# Altium schematic sheet [3] Audio Codec.SchDoc
size Letter
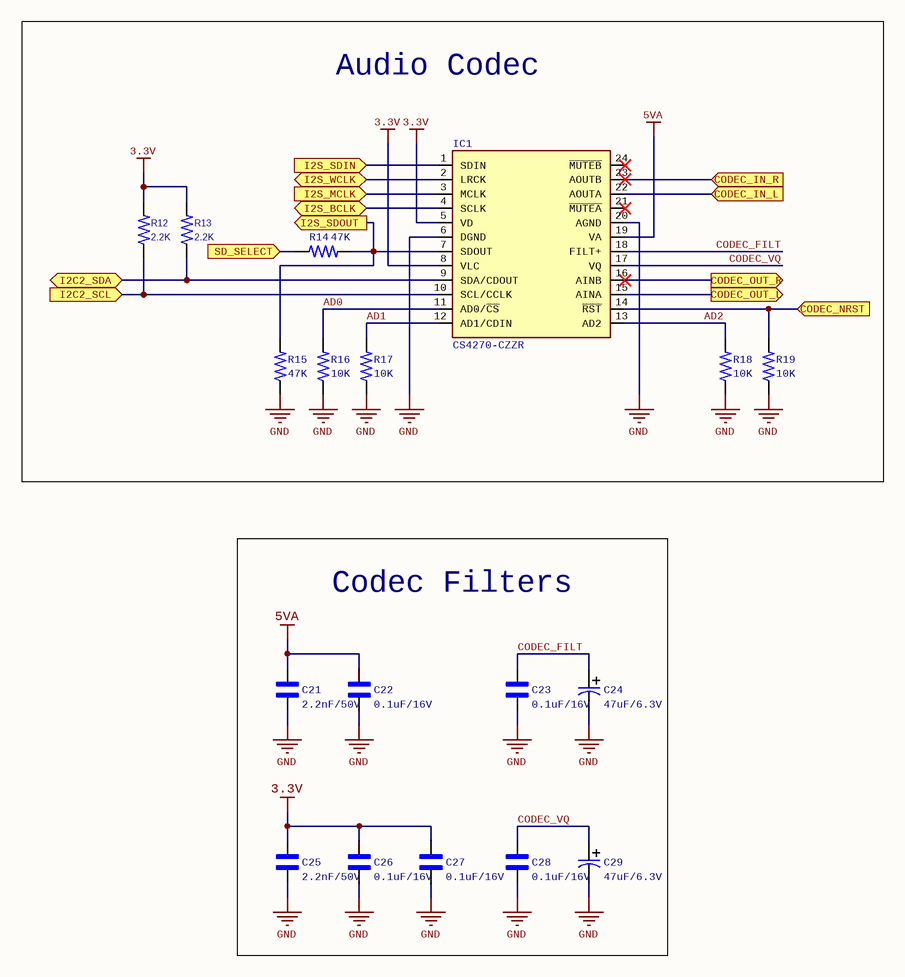
[diagram p0: [3] Audio Codec.SchDoc]

## Parts
C21  2.2nF/50V  [C0603]
C22  0.1uF/16V  [C0603]
C23  0.1uF/16V  [C0603]
C24  47uF/6.3V  [EIA1206]
C25  2.2nF/50V  [C0603]
C26  0.1uF/16V  [C0603]
C27  0.1uF/16V  [C0603]
C28  0.1uF/16V  [C0603]
C29  47uF/6.3V  [EIA1206]
IC1  CS4270-CZZR  [TSSOP-24]
R12  2.2K  [R0603]
R13  2.2K  [R0603]
R14  47K  [R0603]
R15  47K  [R0603]
R16  10K  [R0603]
R17  10K  [R0603]
R18  10K  [R0603]
R19  10K  [R0603]

## Blocks framed on the sheet
Audio Codec: IC1 R12-R19
Codec Filters: C21-C29

## Ports
CODEC_IN_L (in), CODEC_IN_R (in), CODEC_NRST (in), CODEC_OUT_L (out), CODEC_OUT_R (out), I2C2_SCL (in), I2C2_SDA (bidir), I2S_BCLK (bidir), I2S_MCLK (in), I2S_SDIN (in), I2S_SDOUT (out), I2S_WCLK (bidir), SD_SELECT (in)

## Nets
3.3V: C25.1 C26.2 C27.2 IC1.5(VD) IC1.8(VLC) R12.2 R13.2
5VA: C21.1 C22.2 IC1.19(VA)
GND: C21.2 C22.1 C23.1 C24.2 C25.2 C26.1 C27.1 C28.1 C29.2 IC1.6(DGND) IC1.20(AGND) R15.1 R16.1 R17.1 R18.1 R19.1
AD0: IC1.11(AD0/~{CS}) R16.2
AD1: IC1.12(AD1/CDIN) R17.2
AD2: IC1.13(AD2) R18.2
CODEC_FILT: C23.2 C24.1 IC1.18(FILT+)
CODEC_IN_L: IC1.22(AOUTA) ; port CODEC_IN_L
CODEC_IN_R: IC1.23(AOUTB) ; port CODEC_IN_R
CODEC_NRST: IC1.14(~{RST}) R19.2 ; port CODEC_NRST
CODEC_OUT_L: IC1.15(AINA) ; port CODEC_OUT_L
CODEC_OUT_R: IC1.16(AINB) ; port CODEC_OUT_R
CODEC_VQ: C28.2 C29.1 IC1.17(VQ)
I2C2_SCL: IC1.10(SCL/CCLK) R12.1 ; port I2C2_SCL
I2C2_SDA: IC1.9(SDA/CDOUT) R13.1 ; port I2C2_SDA
I2S_BCLK: IC1.4(SCLK) ; port I2S_BCLK
I2S_MCLK: IC1.3(MCLK) ; port I2S_MCLK
I2S_SDIN: IC1.1(SDIN) ; port I2S_SDIN
I2S_SDOUT: IC1.7(SDOUT) R14.2 R15.2 ; port I2S_SDOUT
I2S_WCLK: IC1.2(LRCK) ; port I2S_WCLK
SD_SELECT: R14.1 ; port SD_SELECT

Not connected (* = marked no-connect by the designer): IC1 21(~{MUTEA})* 24(~{MUTEB})*

## Library data of the parts
C21 C25 = C0603 2.2nF/50V: MLCC 2.2nF 10V X5R 10% 0603; Manufacturer: Samsung; Manufacturer Part Number: CL10B222KB8NFNC; Voltage Rating: 50V; Dielectric: X7R; Supplier 1: Mouser; Supplier Part Number 1: 187-CL10B222KB8NFNC; RoHS: Yes; Category: Ceramic Capacitors; Stock 1: 114857; Pricing 1: 1=0.10000, 10=0.03800, 50=0.03800, 100=0.01700, 1000=0.00900, 10000=0.00600 (USD); Mount: Surface Mount; Case/Package: 0603; Case Code (Metric): 1608; Case Code (Imperial): 0603; Min Operating Temperature: -55°C; Max Operating Temperature: 125°C; Package Quantity: 1; Packaging: Tape and Reel; Capacitance: 2.2nF; Tolerance: 10%; Series: CL; Construction: Flat; Length: 0.063inch; Width: 0.031inch; Height: 0.8mm; Thickness: 0.035inch; Depth: 0.8mm; Radiation Hardening: No; RoHS Compliant: Yes
C22 C23 C26-C28 = C0603 0.1uF/16V: MLCC 0.1UF, 16V, X5R, 10%, 0603.; Manufacturer: Kyocera AVX; Manufacturer Part Number: 0603YD104KAT2A; Capacitance: 100nF; Supplier 1: Mouser; Supplier Part Number 1: 581-0603YD104KAT2A; RoHS: Yes; Category: Ceramic Capacitors; Stock 1: 3315; Pricing 1: 1=0.26000, 10=0.11400, 50=0.11400, 100=0.09700, 1000=0.05900, 10000=0.04800 (USD); Mount: Surface Mount; Case/Package: 0603; Number of Pins: 2; Case Code (Imperial): 0603; Case Code (Metric): 1608; Min Operating Temperature: -55°C; Max Operating Temperature: 85°C; Package Quantity: 4000; Voltage Rating: 16V; Voltage Rating (DC): 16V; Tolerance: 10%; Packaging: Tape and Reel; Dielectric: X5R; Termination: SMD/SMT; Length: 1.6mm; Width: 0.81mm; Height: 0.9mm; Thickness: 0.035inch; Depth: 0.81mm; Lead Free: Lead Free; ComponentLink1URL: https://datasheet.ciiva.com/11504/cx5r-11504040.pdf?src-supplier=Avnet; ComponentLink1Description: https://datasheet.ciiva.com/11504/cx5r-11504040.pdf?src-supplier=Avnet; ComponentLink2URL: https://datasheet.ciiva.com/208/cx5r-208121.pdf?src-supplier=Digi-Key; ComponentLink2Description: https://datasheet.ciiva.com/208/cx5r-208121.pdf?src-supplier=Digi-Key
C24 C29 = TANT 47UF/6.3V: Tantalum Capacitors - Solid SMD 6.3V 47uF 10%; Manufacturer: Kyocera AVX; Manufacturer Part Number: TAJA476K006SNJV; Supplier 1: Mouser; Supplier Part Number 1: 581-TAJA476K006SNJV; RoHS: Yes; Category: Tantalum Capacitors; Stock 1: 97469; Pricing 1: 1=0,57000, 10=0,39900, 50=0,39900, 100=0,20200, 1000=0,15200, 10000=0,12500 (USD); Case/Package: Radial; Voltage Rating (DC): 6.3V; Capacitance: 47uF; Tolerance: 10%; Lead Free: Lead Free; RoHS Compliant: Yes
IC1 = CS4270-CZZR: Audio Codec 2ADC / 2DAC 24-Bit 24-Pin TSSOP T/R (Alt: CS4270-CZZR); Manufacturer: Cirrus Logic; Interface: I2C,SPI,Serial; Resolution: 24b; Number of A/D Converters: 2; Sampling Rate: 216KS/s; Supplier 1: Mouser; Manufacturer Part Number: CS4270-CZZR; RoHS: Yes; Category: CODECs; Stock 1: 20885; Pricing 1: 1=7.04, 10=6.36, 50=6.06, 100=5.27, 1000=4.4, 10000=4.4 (USD); Mount: Surface Mount; Case/Package: TSSOP; Number of Pins: 24; Contact Plating: Tin,Matte; Min Operating Temperature: -10°C; Max Operating Temperature: 70°C; Packaging: Tape and Reel; Package Quantity: 4000; Number of D/A Converters: 2; Series: -; RoHS Compliant: Yes; Supplier Part Number 1: 777-CS4270-CZZR
R12 R13 = R0603 2.2K: RES 0603 2.2K OHM 1% 1/10W; Manufacturer: Yageo; Manufacturer Part Number: RC0603FR-072K2L; Resistance: 2.2kR; Temperature Coefficient: 100ppm/°C; Power Rating: 100mW; Voltage Rating: 50V; Supplier 1: Mouser; Supplier Part Number 1: 603-RC0603FR-072K2L; RoHS: Yes; Category: Chip SMD Resistors; Stock 1: 372094; Pricing 1: 1=0.100000, 10=0.018000, 50=0.018000, 100=0.006000, 1000=0.005000, 10000=0.003000 (USD); Case/Package: 0603; Case Code (Imperial): 0603; Case Code (Metric): 1608; Size Code: 0603; Min Operating Temperature: -55°C; Max Operating Temperature: 155°C; Tolerance: 1%; Packaging: Tape and Reel; Resistor Type: Thick Film; Package Quantity: 1; Termination: SMD/SMT; Number of Terminations: 2; Max Power Dissipation: 100mW; Features: Moisture Resistant; Series: RC; Resistance Tolerance: 1%; Construction: Rectangular; Length: 1.6mm; Width: 0.031inch; Height: 0.022inch; Depth: 0.8mm; REACH SVHC: No SVHC; Lead Free: Lead Free; Military Standard: Not; RoHS Compliant: Yes
R14 = R0603 47K: RES 0603 47K 1% 1/10W; Manufacturer: Yageo; Manufacturer Part Number: RC0603FR-0747KL; Resistance: 47kR; Power Rating: 100mW; Voltage Rating (DC): 50V; Temperature Coefficient: 100ppm/°C; Supplier 1: Mouser; Supplier Part Number 1: 603-RC0603FR-0747KL; RoHS: Yes; Category: Chip SMD Resistors; Stock 1: 158656; Case/Package: 0603; Number of Pins: 2; Case Code (Imperial): 0603; Case Code (Metric): 1608; Min Operating Temperature: -55°C; Max Operating Temperature: 155°C; Tolerance: 1%; Packaging: Tape and Reel; Voltage Rating: 50V; Package Quantity: 1; Termination: SMD/SMT; Resistor Type: Thick Film; Number of Terminations: 2; Max Power Dissipation: 100mW; Features: Moisture Resistant; Length: 1.6mm; Width: 0.031inch; Height: 0.022inch; Depth: 0.8mm; REACH SVHC: Unknown; Lead Free: Lead Free; Military Standard: Not; Pricing 1: 1=0.10000, 10=0.02400, 50=0.02400, 100=0.01000, 1000=0.00400, 10000=0.00200 (USD); Size Code: 0603; Series: RC; Resistance Tolerance: 1%; Technology: THICK FILM; Construction: Rectangular; RoHS Compliant: Yes
R15 = R0603 47K: RES 0603 47K 1% 1/10W; Manufacturer: Yageo; Manufacturer Part Number: RC0603FR-0747KL; Resistance: 47kR; Temperature Coefficient: 100ppm/°C; Power Rating: 100mW; Voltage Rating: 50V; Supplier 1: Mouser; Supplier Part Number 1: 603-RC0603FR-0747KL; RoHS: Yes; Category: Chip SMD Resistors; Stock 1: 158656; Pricing 1: 1=0.10000, 10=0.02400, 50=0.02400, 100=0.01000, 1000=0.00400, 10000=0.00200 (USD); Case/Package: 0603; Number of Pins: 2; Case Code (Metric): 1608; Case Code (Imperial): 0603; Size Code: 0603; Min Operating Temperature: -55°C; Max Operating Temperature: 155°C; Tolerance: 1%; Resistor Type: Thick Film; Packaging: Tape and Reel; Voltage Rating (DC): 50V; Package Quantity: 1; Number of Terminations: 2; Termination: SMD/SMT; Max Power Dissipation: 100mW; Features: Moisture Resistant; Series: RC; Resistance Tolerance: 1%; Technology: THICK FILM; Construction: Rectangular; Length: 1.6mm; Width: 0.031inch; Height: 0.022inch; Depth: 0.8mm; REACH SVHC: Unknown; Military Standard: Not; Lead Free: Lead Free; RoHS Compliant: Yes
R16-R19 = R0603 10K: RES 0603 10K OHM 1% 1/10W; Manufacturer: Yageo; Manufacturer Part Number: RC0603FR-0710KP; Resistance: 10kR; Max Power Dissipation: 100mW; Temperature Coefficient: 150ppm/°C; Supplier 1: Mouser; Supplier Part Number 1: 603-RC0603FR-0710KP; RoHS: Yes; Category: Chip SMD Resistors; Stock 1: 6316; Pricing 1: 1=0.18000, 10=0.04200, 50=0.04200, 100=0.01400, 1000=0.01000, 10000=0.00600 (USD); Case/Package: 0603; Case Code (Metric): 1608; Case Code (Imperial): 0603; Min Operating Temperature: -55°C; Max Operating Temperature: 155°C; Packaging: Tape and Reel; Tolerance: 1%; Resistor Type: Thick Film; Number of Terminations: 2; Features: Moisture Resistant; Length: 0.063inch; Width: 0.031inch; Height: 0.022inch; RoHS Compliant: Yes